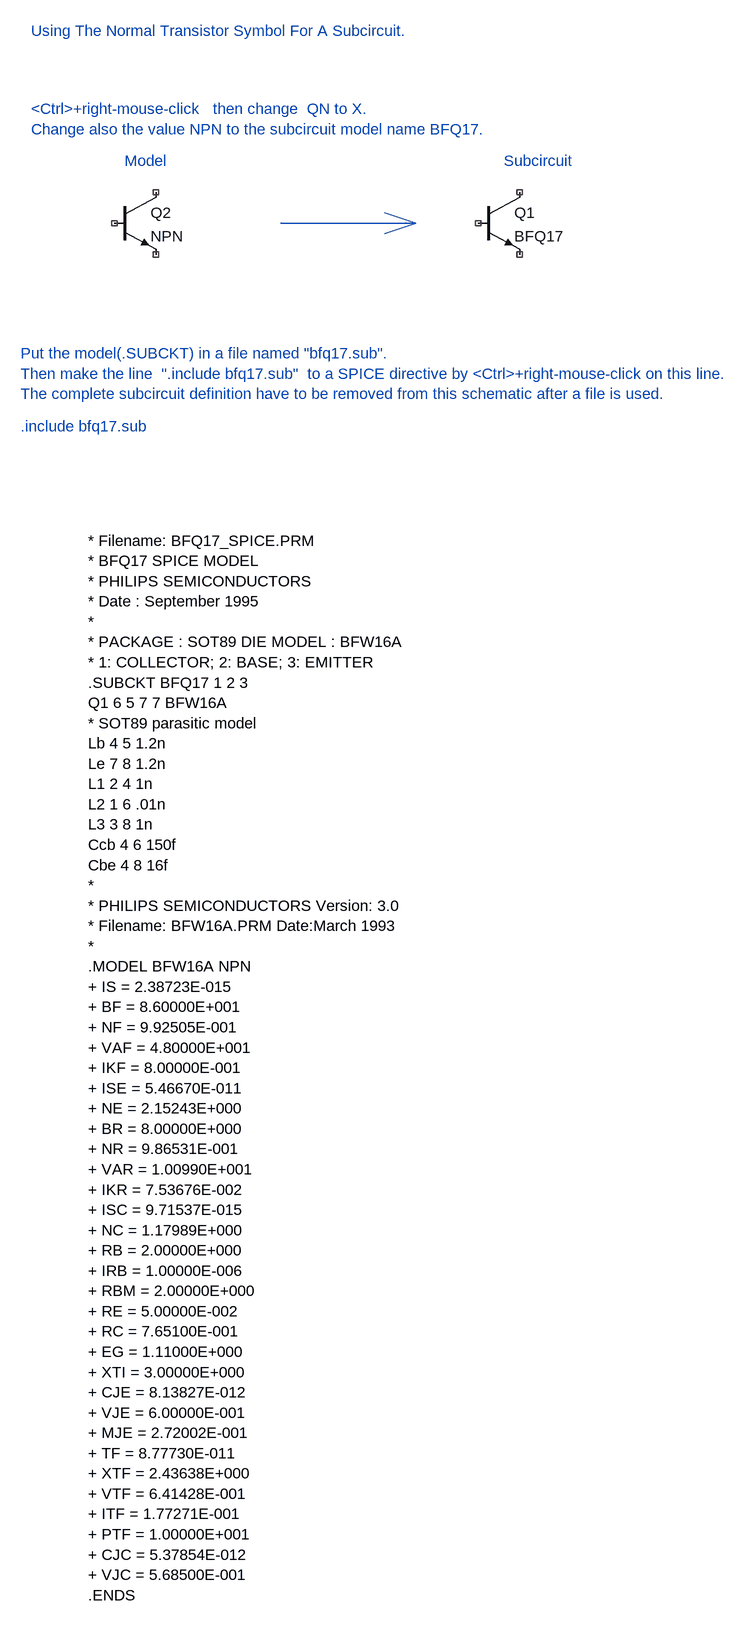
[diagram p0: schematic NPN_model_to_sub.asc]
NPN_model_to_sub.asc, the LTspice schematic file:
Version 4
SHEET 1 904 2184
SYMBOL npn 256 176 R0
SYMATTR InstName Q1
SYMATTR Value BFQ17
SYMATTR Prefix X
SYMBOL npn -304 176 R0
SYMATTR InstName Q2
TEXT -344 712 Left 0 !* Filename: BFQ17_SPICE.PRM\n* BFQ17 SPICE MODEL\n* PHILIPS SEMICONDUCTORS\n* Date : September 1995\n*\n* PACKAGE : SOT89 DIE MODEL : BFW16A\n* 1: COLLECTOR; 2: BASE; 3: EMITTER\n.SUBCKT BFQ17 1 2 3\nQ1 6 5 7 7 BFW16A\n* SOT89 parasitic model\nLb 4 5 1.2n\nLe 7 8 1.2n\nL1 2 4 1n\nL2 1 6 .01n\nL3 3 8 1n\nCcb 4 6 150f\nCbe 4 8 16f\n*\n* PHILIPS SEMICONDUCTORS Version: 3.0\n* Filename: BFW16A.PRM Date:March 1993\n*\n.MODEL BFW16A NPN\n+ IS = 2.38723E-015\n+ BF = 8.60000E+001\n+ NF = 9.92505E-001\n+ VAF = 4.80000E+001\n+ IKF = 8.00000E-001\n+ ISE = 5.46670E-011\n+ NE = 2.15243E+000\n+ BR = 8.00000E+000\n+ NR = 9.86531E-001\n+ VAR = 1.00990E+001\n+ IKR = 7.53676E-002\n+ ISC = 9.71537E-015\n+ NC = 1.17989E+000\n+ RB = 2.00000E+000\n+ IRB = 1.00000E-006\n+ RBM = 2.00000E+000\n+ RE = 5.00000E-002\n+ RC = 7.65100E-001\n+ EG = 1.11000E+000\n+ XTI = 3.00000E+000\n+ CJE = 8.13827E-012\n+ VJE = 6.00000E-001\n+ MJE = 2.72002E-001\n+ TF = 8.77730E-011\n+ XTF = 2.43638E+000\n+ VTF = 6.41428E-001\n+ ITF = 1.77271E-001\n+ PTF = 1.00000E+001\n+ CJC = 5.37854E-012\n+ VJC = 5.68500E-001\n.ENDS
TEXT -448 536 Left 0 ;.include bfq17.sub
TEXT -448 424 Left 0 ;Put the model(.SUBCKT) in a file named "bfq17.sub".\nThen make the line  ".include bfq17.sub"  to a SPICE directive by <Ctrl>+right-mouse-click on this line.\nThe complete subcircuit definition have to be removed from this schematic after a file is used.
TEXT -432 48 Left 0 ;<Ctrl>+right-mouse-click   then change  QN to X.\nChange also the value NPN to the subcircuit model name BFQ17.
TEXT -432 -72 Left 0 ;Using The Normal Transistor Symbol For A Subcircuit.
TEXT 296 128 Left 0 ;Subcircuit
TEXT -288 128 Left 0 ;Model
LINE Normal 160 224 -48 224
LINE Normal 112 208 160 224
LINE Normal 112 240 160 224

The netlist it stands for:
* NPN_model_to_sub.asc
XQ1 NC_01 NC_02 NC_03 BFQ17  ; pins C B E
Q2 NC_04 NC_05 NC_06 0 NPN
.model NPN NPN
.model PNP PNP
.lib standard.bjt
* Filename: BFQ17_SPICE.PRM
* BFQ17 SPICE MODEL
* PHILIPS SEMICONDUCTORS
* Date : September 1995
*
* PACKAGE : SOT89 DIE MODEL : BFW16A
* 1: COLLECTOR; 2: BASE; 3: EMITTER
.SUBCKT BFQ17 1 2 3
Q1 6 5 7 7 BFW16A
* SOT89 parasitic model
Lb 4 5 1.2n
Le 7 8 1.2n
L1 2 4 1n
L2 1 6 .01n
L3 3 8 1n
Ccb 4 6 150f
Cbe 4 8 16f
*
* PHILIPS SEMICONDUCTORS Version: 3.0
* Filename: BFW16A.PRM Date:March 1993
*
.MODEL BFW16A NPN
+ IS = 2.38723E-015
+ BF = 8.60000E+001
+ NF = 9.92505E-001
+ VAF = 4.80000E+001
+ IKF = 8.00000E-001
+ ISE = 5.46670E-011
+ NE = 2.15243E+000
+ BR = 8.00000E+000
+ NR = 9.86531E-001
+ VAR = 1.00990E+001
+ IKR = 7.53676E-002
+ ISC = 9.71537E-015
+ NC = 1.17989E+000
+ RB = 2.00000E+000
+ IRB = 1.00000E-006
+ RBM = 2.00000E+000
+ RE = 5.00000E-002
+ RC = 7.65100E-001
+ EG = 1.11000E+000
+ XTI = 3.00000E+000
+ CJE = 8.13827E-012
+ VJE = 6.00000E-001
+ MJE = 2.72002E-001
+ TF = 8.77730E-011
+ XTF = 2.43638E+000
+ VTF = 6.41428E-001
+ ITF = 1.77271E-001
+ PTF = 1.00000E+001
+ CJC = 5.37854E-012
+ VJC = 5.68500E-001
.ENDS
* .include bfq17.sub
* Put the model(.SUBCKT) in a file named "bfq17.sub".
* Then make the line  ".include bfq17.sub"  to a SPICE directive by <Ctrl>+right-mouse-click on this line.
* The complete subcircuit definition have to be removed from this schematic after a file is used.
* <Ctrl>+right-mouse-click   then change  QN to X.
* Change also the value NPN to the subcircuit model name BFQ17.
* Using The Normal Transistor Symbol For A Subcircuit.
* Subcircuit
* Model
.backanno
.end